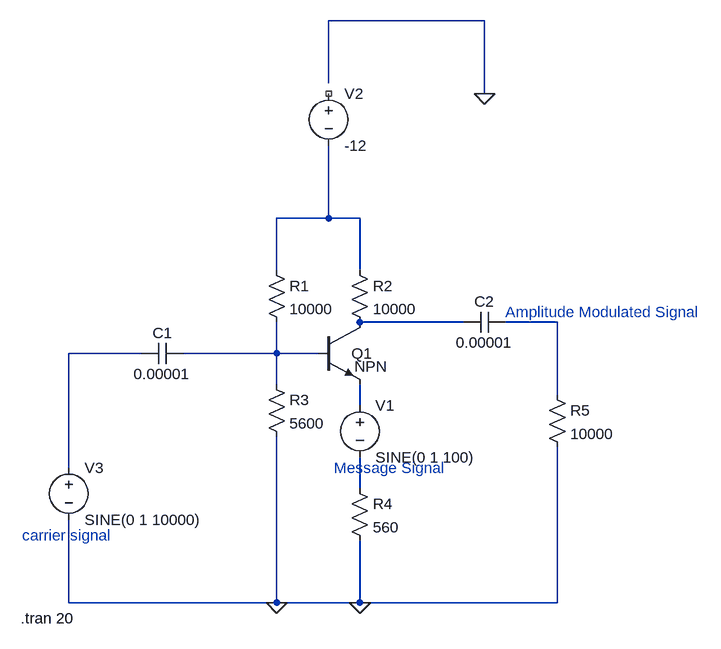
[diagram p0: schematic am using carrier.asc]
am using carrier.asc, the LTspice schematic file:
Version 4
SHEET 1 888 680
WIRE 528 -304 288 -304
WIRE 288 -208 288 -304
WIRE 528 -192 528 -304
WIRE 288 0 288 -112
WIRE 288 0 208 0
WIRE 336 0 288 0
WIRE 208 80 208 0
WIRE 336 80 336 0
WIRE 496 160 336 160
WIRE 640 160 560 160
WIRE 0 208 -112 208
WIRE 208 208 208 160
WIRE 208 208 64 208
WIRE 272 208 208 208
WIRE 208 256 208 208
WIRE 640 272 640 160
WIRE 336 288 336 256
WIRE -112 384 -112 208
WIRE 336 416 336 368
WIRE -112 592 -112 464
WIRE 208 592 208 336
WIRE 208 592 -112 592
WIRE 336 592 336 496
WIRE 336 592 208 592
WIRE 640 592 640 352
WIRE 640 592 336 592
FLAG 208 592 0
FLAG 528 -192 0
FLAG 336 592 0
SYMBOL res 192 64 R0
SYMATTR InstName R1
SYMATTR Value 10000
SYMBOL res 320 64 R0
SYMATTR InstName R2
SYMATTR Value 10000
SYMBOL res 192 240 R0
SYMATTR InstName R3
SYMATTR Value 5600
SYMBOL voltage 336 272 R0
WINDOW 123 0 0 Left 0
WINDOW 39 0 0 Left 0
SYMATTR InstName V1
SYMATTR Value SINE(0 1 100)
SYMBOL voltage 288 -208 R0
WINDOW 123 0 0 Left 0
WINDOW 39 0 0 Left 0
SYMATTR InstName V2
SYMATTR Value -12
SYMBOL res 320 400 R0
SYMATTR InstName R4
SYMATTR Value 560
SYMBOL res 624 256 R0
SYMATTR InstName R5
SYMATTR Value 10000
SYMBOL voltage -112 368 R0
WINDOW 123 0 0 Left 0
WINDOW 39 0 0 Left 0
SYMATTR InstName V3
SYMATTR Value SINE(0 1 10000)
SYMBOL cap 64 192 R90
WINDOW 0 0 32 VBottom 2
WINDOW 3 32 32 VTop 2
SYMATTR InstName C1
SYMATTR Value 0.00001
SYMBOL cap 496 144 M90
WINDOW 0 0 32 VBottom 2
WINDOW 3 32 32 VTop 2
SYMATTR InstName C2
SYMATTR Value 0.00001
SYMBOL npn 272 160 R0
WINDOW 0 51 48 Left 2
SYMATTR InstName Q1
TEXT -184 488 Left 2 ;carrier signal
TEXT 296 384 Left 2 ;Message Signal
TEXT 560 144 Left 2 ;Amplitude Modulated Signal
TEXT -186 616 Left 2 !.tran 20

The netlist it stands for:
* am using carrier.asc
R1 N001 N005 10000
R2 N001 N002 10000
R3 N005 0 5600
V1 N006 N007 SINE(0 1 100)
V2 NC_01 N001 -12
R4 N007 0 560
R5 N003 0 10000
V3 N004 0 SINE(0 1 10000)
C1 N005 N004 0.00001
C2 N002 N003 0.00001
Q1 N002 N005 N006 0 NPN
.model NPN NPN
.model PNP PNP
.lib standard.bjt
* carrier signal
* Message Signal
* Amplitude Modulated Signal
.tran 20
.backanno
.end